# EAGLE design mosfets (EAGLE 7.7.0)
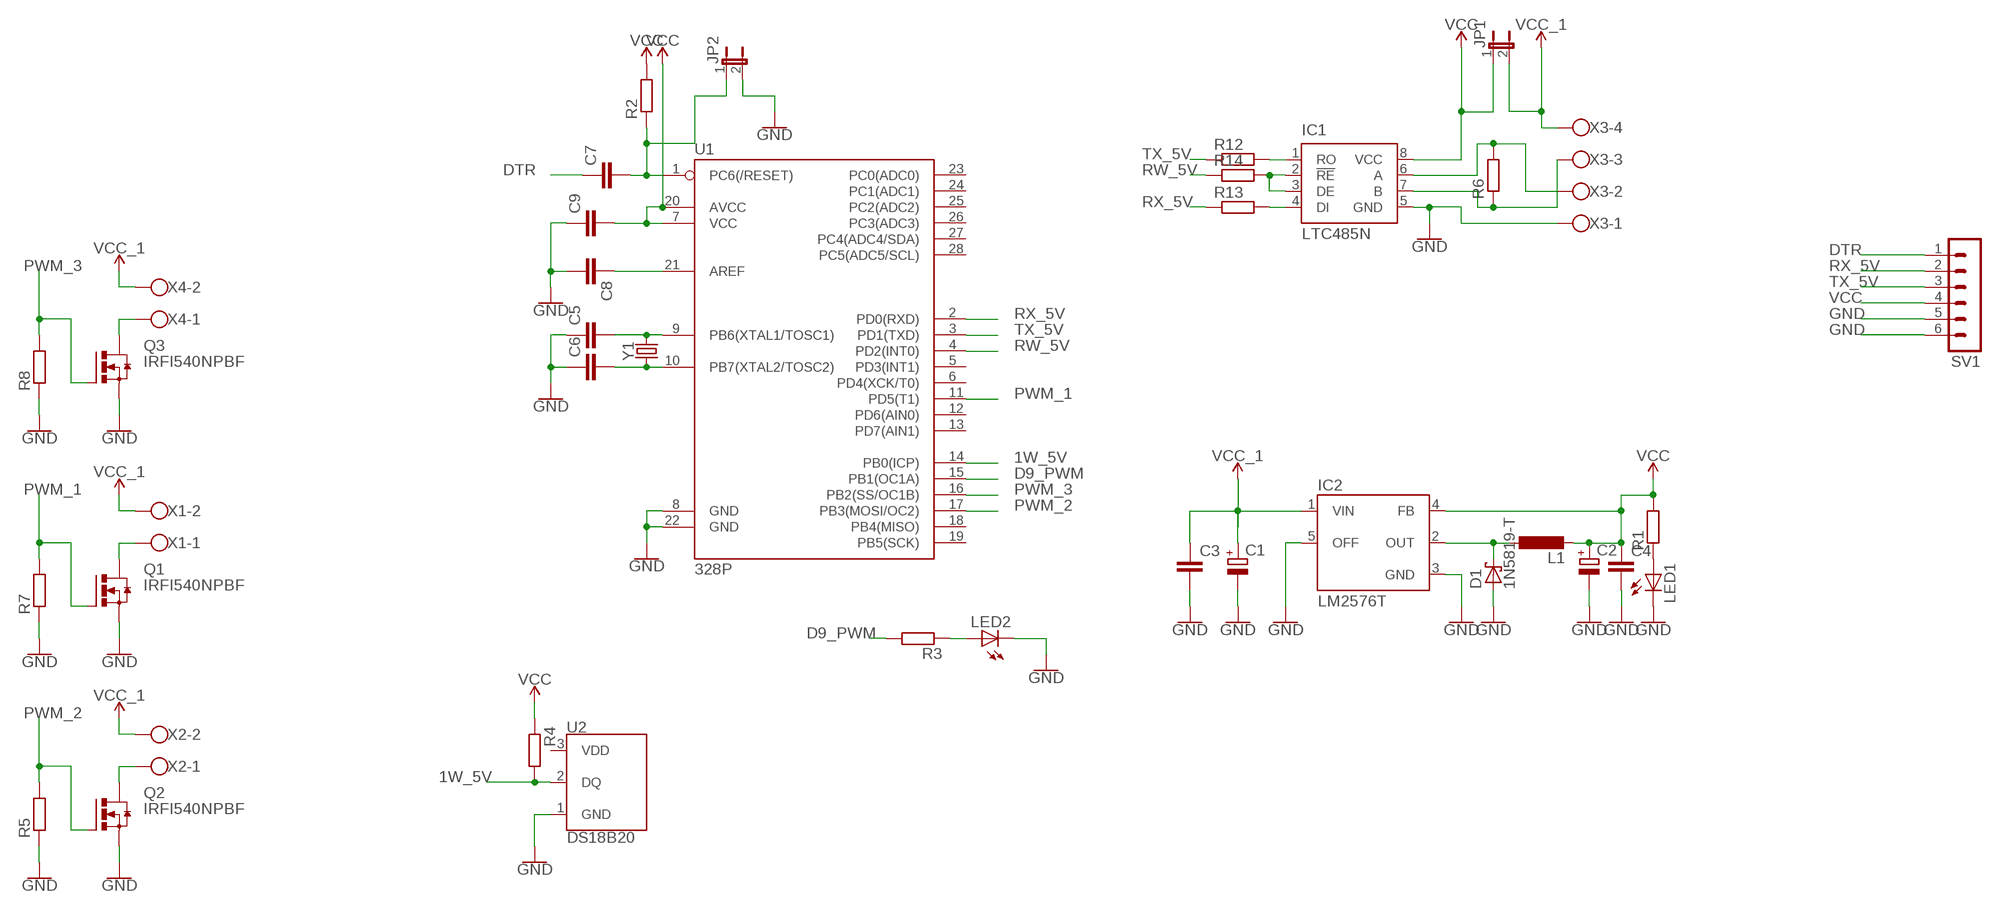
[diagram p0: schematic, sheet 1]

## Parts
C1  CPOL-EUE5-10.5  [E5-10,5]
C2  CPOL-EUE5-10.5  [E5-10,5]
C3  C-EU025-025X050  [C025-025X050]
C4  C-EU025-025X050  [C025-025X050]
C5  C-EU025-025X050  [C025-025X050]
C6  C-EU025-025X050  [C025-025X050]
C7  C-EU025-025X050  [C025-025X050]
C8  C-EU025-025X050  [C025-025X050]
C9  C-EU025-025X050  [C025-025X050]
D1  1N5819-T  [DO41-7.6]
IC1  LTC485N  [DIL08]
IC2  LM2576T  [TO220-5]
JP1  JP1E  [JP1]
JP2  JP1E  [JP1]
L1  L-EUTJ3-U1  [TJ3-U1]
LED1  LED5MM  [LED5MM]
LED2  LED5MM  [LED5MM]
Q1  IRFI540NPBF  [TO220BH]
Q2  IRFI540NPBF  [TO220BH]
Q3  IRFI540NPBF  [TO220BH]
R1  R-EU_0204/7  [0204/7]
R2  R-EU_0204/7  [0204/7]
R3  R-EU_0204/7  [0204/7]
R4  R-EU_0204/7  [0204/7]
R5  R-EU_0204/7  [0204/7]
R6  R-EU_0204/7  [0204/7]
R7  R-EU_0204/7  [0204/7]
R8  R-EU_0204/7  [0204/7]
R12  R-EU_0204/7  [0204/7]
R13  R-EU_0204/7  [0204/7]
R14  R-EU_0204/7  [0204/7]
SV1  MA06-1  [MA06-1]
U1  328P  ATMEGA328P_PDIP  [DIP28]
U2  DS18B20  [TO-92-AMMO]
X1  W237-102  [W237-102]
X2  W237-102  [W237-102]
X3  W237-4  [W237-4]
X4  W237-102  [W237-102]
Y1  CRYSTALPTH-HC49US  [HC49US]

## Nets
1W_5V: R4.2 U1.14(PB0(ICP)) U2.2(DQ)
D9_PWM: R3.2 U1.15(PB1(OC1A))
DTR: C7.1 SV1.1
GND: C1.- C2.- C3.2 C4.2 C5.1 C6.1 C8.2 C9.1 D1.A IC1.5(GND) IC2.3(GND) IC2.5(OFF) JP2.2 LED1.K(C) LED2.K(C) Q1.S Q2.S Q3.S R5.1 R7.1 R8.1 SV1.5 SV1.6 U1.8(GND) U1.22(GND) U2.1(GND) X3.1
N$1: LED1.A R1.1
N$2: C5.2 U1.9(PB6(XTAL1/TOSC1)) Y1.2
N$3: C6.2 U1.10(PB7(XTAL2/TOSC2)) Y1.1
N$4: IC1.4(DI) R13.2
N$5: IC1.7(B) R6.1 X3.3
N$6: C8.1 U1.21(AREF)
N$7: LED2.A R3.1
N$8: IC1.1(RO) R12.2
N$9: D1.C IC2.2(OUT) L1.1
N$10: C7.2 JP2.1 R2.1 U1.1(PC6(/RESET))
N$11: IC1.6(A) R6.2 X3.2
N$12: Q1.D X1.1
N$13: IC1.2(!RE) IC1.3(DE) R14.2
N$16: Q2.D X2.1
N$17: Q3.D X4.1
PWM_1: Q1.G R7.2 U1.11(PD5(T1))
PWM_2: Q2.G R5.2 U1.17(PB3(MOSI/OC2))
PWM_3: Q3.G R8.2 U1.16(PB2(SS/OC1B))
RW_5V: R14.1 U1.4(PD2(INT0))
RX_5V: R13.1 SV1.2 U1.2(PD0(RXD))
TX_5V: R12.1 SV1.3 U1.3(PD1(TXD))
VCC: C2.+ C4.1 C9.2 IC1.8(VCC) IC2.4(FB) JP1.1 L1.2 R1.2 R2.2 R4.1 SV1.4 U1.7(VCC) U1.20(AVCC)
VCC_1: C1.+ C3.1 IC2.1(VIN) JP1.2 X1.2 X2.2 X3.4 X4.2
Unconnected: U1.5(PD3(INT1)) U1.6(PD4(XCK/T0)) U1.12(PD6(AIN0)) U1.13(PD7(AIN1)) U1.18(PB4(MISO)) U1.19(PB5(SCK)) U1.23(PC0(ADC0)) U1.24(PC1(ADC1)) U1.25(PC2(ADC2)) U1.26(PC3(ADC3)) U1.27(PC4(ADC4/SDA)) U1.28(PC5(ADC5/SCL))

## Power pins joined to a net without a drawn wire
VDD: U2.3(VDD)

## Library data of the parts
C1 C2 = rcl:CPOL-EU: POLARIZED CAPACITOR, European symbol
C3-C9 = rcl:C-EU: CAPACITOR, European symbol
D1 = diode:1N581*: 1.0A SCHOTTKY BARRIER RECTIFIER Source: http://www.diodes.com/datasheets/ds23001.pdf
IC1 = linear-technology:LTC485: Low Power RS485 Interface Transceiver Source: http://www.linear.com/pc/downloadDocument.do?navId=H0,C1,C1007,C1017,P2064,D1718; OC_FARNELL: unknown; OC_NEWARK: unknown
IC2 = v-reg-3:LM2576: National Semiconductor <http://www.national.com> 3.0A "Simple Switcher"(c) 52kHz, Vout 1.23-37V (HV: 57V), Vin 40V (HV: 60V), 50µA standby current
JP1 JP2 = jumper:JP1E: JUMPER
L1 = resistor:L-EU: INDUCTOR, European symbol
LED1 LED2 = led:LED: LED OSRAM: - CHIPLED LG R971, LG N971, LY N971, LG Q971, LY Q971, LO R971, LY R971 LH N974, LH R974 LS Q976, LO Q976, LY Q976 LO Q996 - Hyper CHIPLED LW Q18S LB Q993, LB Q99A, LB R99A - SideLED LS A670, LO A670, LY A670, LG A670, LP A670 LB A673, LV A673, LT A673, LW A673 LH A674 LY A675 LS A676, LA A676, LO A676, LY A676, LW A676 LS A679, LY A679, LG A679 - Hyper Micro SIDELED® LS Y876, LA Y876, LO Y876, LY Y876 LT Y87S - SmartLED LW L88C, LW L88S LB L89C, LB L89S, LG L890 LS L89K, LO L89K, LY L89K LS L896, LA L896, LO L896, LY L896 - TOPLED LS T670, LO T670, LY T670, LG T670, LP T670 LSG T670, LSP T670, LSY T670, LOP T670, LYG T670 LG T671, LOG T671, LSG T671 LB T673, LV T673, LT T673, LW T673 LH T674 LS T676, LA T676, LO T676, LY T676, LB T676, LH T676, LSB T676, LW T676 LB T67C, LV T67C, LT T67C, LS T67K, LO T67K, LY T67K, LW E67C LS E67B, LA E67B, LO E67B, LY E67B, LB E67C, LV E67C, LT E67C LW T67C LS T679, LY T679, LG T679 LS T770, LO T770, LY T770, LG T770, LP T770 LB T773, LV T773, LT T773, LW T773 LH T774 LS E675, LA E675, LY E675, LS T675 LS T776, LA T776, LO T776, LY T776, LB T776 LHGB T686 LT T68C, LB T68C - Hyper Mini TOPLED® LB M676 - Mini TOPLED Santana® LG M470 LS M47K, LO M47K, LY M47K Source: http://www.osram.convergy.de LUXEON: - LUMILED® LXK2-PW12-R00, LXK2-PW12-S00, LXK2-PW14-U00, LXK2-PW14-V00 LXK2-PM12-R00, LXK2-PM12-S00, LXK2-PM14-U00 LXK2-PE12-Q00, LXK2-PE12-R00, LXK2-PE12-S00, LXK2-PE14-T00, LXK2-PE14-U00 LXK2-PB12-K00, LXK2-PB12-L00, LXK2-PB12-M00, LXK2-PB14-N00, LXK2-PB14-P00, LXK2-PB14-Q00 LXK2-PR12-L00, LXK2-PR12-M00, LXK2-PR14-Q00, LXK2-PR14-R00 LXK2-PD12-Q00, LXK2-PD12-R00, LXK2-PD12-S00 LXK2-PH12-R00, LXK2-PH12-S00 LXK2-PL12-P00, LXK2-PL12-Q00, LXK2-PL12-R00 Source: www.luxeon.com KINGBRIGHT: KA-3528ASYC Source: www.kingbright.com
Q1-Q3 = transistor-power:IRFI540NPBF: HEXFET Power MOISFET VDSS = 100V, RDS(on) = 0.052 Ohm, ID = 20A, VGS(th) = 2.0 -- 4.0V Source: http://www.irf.com/product-info/datasheets/data/irfi540npbf.pdf
R1-R8 R12-R14 = rcl:R-EU_: RESISTOR, European symbol
SV1 = con-lstb:MA06-1: PIN HEADER; OC_FARNELL: unknown; OC_NEWARK: unknown
U1 = SparkFun-IC-Microcontroller:ATMEGA328P_PDIP: Atmel 328P Through hole ATMEGA328P uC used in the Arduino 32kb flash, 1k EEPROM, 2k SRAM Datasheet <http://www.sparkfun.com/datasheets/Components/SMD/ATMega328.pdf> SparkFun Products Storefront component: AVR 28 Pin 20MHz 32K 6A/D - ATMega328P <https://www.sparkfun.com/products/9061> (COM-09061) SparkFun Simon Says - Through-Hole Soldering Kit <https://www.sparkfun.com/products/10547> (KIT-10547) SparkFun Learn to Solder - Simon Says <https://www.sparkfun.com/products/13708> (KIT-13708) SparkFun BigTime Watch Kit <https://www.sparkfun.com/products/11734> (KIT-11734) SparkFun ClockIt <https://www.sparkfun.com/products/10930> (KIT-10930) SparkFun Serial Enabled LCD Kit <https://www.sparkfun.com/products/10097> (LCD-10097) SparkFun Simon Tilts - Through Hole Soldering Kit <https://www.sparkfun.com/products/12634> (KIT-12634) SparkFun Frequency Counter Kit <https://www.sparkfun.com/products/10140> (KIT-10140) FabFM Radio Kit <https://www.sparkfun.com/products/11043> (KIT-11043) SparkFun Binary Blaster Kit <https://www.sparkfun.com/products/12037> (KIT-12037) SparkFun Metro-Gnome <https://www.sparkfun.com/products/9236> (KIT-09236) ATmega328 with Arduino Optiboot (Uno) <https://www.sparkfun.com/products/10524> (DEV-10524); PROD_ID: IC-09136
U2 = SparkFun-Sensors:DS18B20: Dallas/Maxim DS18B20 1-Wire Temperature Sensor The DS18B20 reports degrees C with 9 to 12-bit precision, -55C to 125C (+/-0.5C). Each sensor has a unique 64-Bit Serial number etched into it - allows for a huge number of sensors to be used on one data bus. Datasheet <http://datasheets.maximintegrated.com/en/ds/DS18B20.pdf> SparkFun Products One Wire Digital Temperature Sensor - DS18B20 <https://www.sparkfun.com/products/245> (SEN-00245); STORE_ID: SEN-00245
X1 X2 X4 = con-wago-500:W237-102: WAGO SCREW CLAMP; MPN: 237-102; OC_FARNELL: unknown; OC_NEWARK: 70K9898
X3 = con-wago-500:W237-4: WAGO SCREW CLAMP; OC_FARNELL: unknown; OC_NEWARK: unknown
Y1 = SparkFun-Clocks:CRYSTAL: Crystals (Generic) These are passive quartz crystals, which can be used as a clock source for a microcontroller. Crystal's are two-terminal devices. They require external "load" capacitors to generate an oscillating signal.

## Board
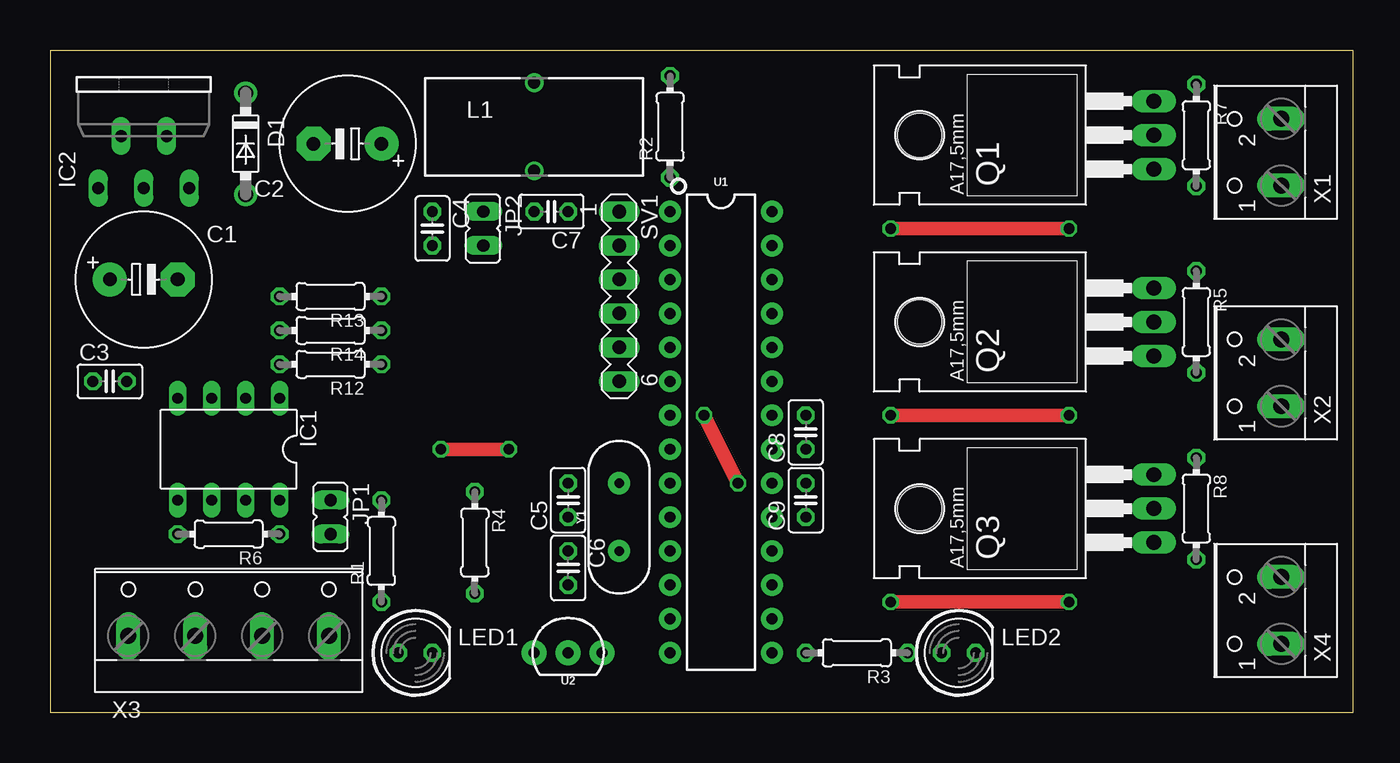
[diagram p1: board, top side]
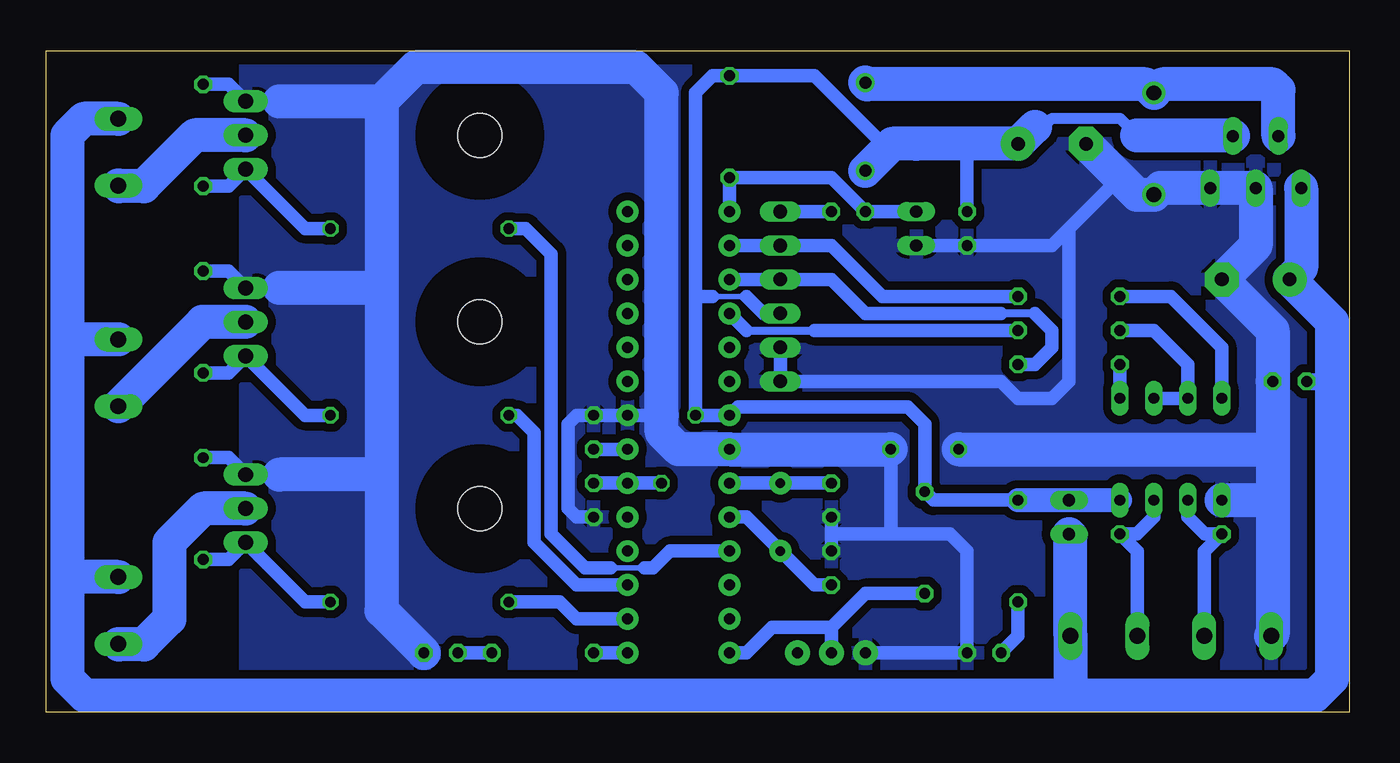
[diagram p2: board, bottom side, seen from below]

Size 97.46 x 49.52 mm. Coordinates in mm from the lower left corner, seen from the top.
Outline: 0,0 97.46,0 97.46,49.52 0,49.52 0,0
Copper layers (1*16): Top 0.035mm / dielectric 1.5mm / Bottom 0.035mm
Design rules "default": minimum track width 10mil, minimum drill 24mil, track to track 8mil, track to pad 8mil, pad to pad 8mil, via to via 8mil, smd to smd 8mil, copper to edge 40mil, drill to drill 8mil, minimum pad ring 10mil, minimum via ring 8mil, stop-mask expansion 4mil, vias tented up to drill 0mil, thermal gap 10mil

### Footprints (pad centres in the part's own frame; a part is rotated, then mirrored left to right if it is on the bottom)
E5-10,5 = drill 1.016 pad 2.54: + -2.54,0 | drill 1.016 pad 2.54 octagon: - 2.54,0
C025-025X050 = drill 0.813 octagon: 1 -1.27,0; 2 1.27,0
DO41-7.6 = drill 1.1 pad 1.7: A 3.81,0; C -3.81,0
DIL08 = drill 0.813 long: 1 -3.81,-3.81; 2 -1.27,-3.81; 3 1.27,-3.81; 4 3.81,-3.81; 5 3.81,3.81; 6 1.27,3.81; 7 -1.27,3.81; 8 -3.81,3.81
TO220-5 = drill 0.9 long: 1 -3.4,-8.4; 2 -1.7,-4.5; 3 0,-8.4; 4 1.7,-4.5; 5 3.4,-8.4
JP1 = drill 0.914 long: 1 0,-1.27; 2 0,1.27
TJ3-U1 = drill 0.9: 1 -3.3,0; 2 3.3,0
LED5MM = drill 0.813 octagon: A -1.27,0; K 1.27,0
TO220BH = drill 1.118 long: D 0,-6.35; G -2.54,-6.35; S 2.54,-6.35 | hole 3.302: 0,11.176
0204/7 = drill 0.813 octagon: 1 -3.81,0; 2 3.81,0
MA06-1 = drill 1.016 long: 1 -6.35,0; 2 -3.81,0; 3 -1.27,0; 4 1.27,0; 5 3.81,0; 6 6.35,0
DIP28 = drill 0.813 pad 1.626: 1 -16.51,-3.81; 2 -13.97,-3.81; 3 -11.43,-3.81; 4 -8.89,-3.81; 5 -6.35,-3.81; 6 -3.81,-3.81; 7 -1.27,-3.81; 8 1.27,-3.81; 9 3.81,-3.81; 10 6.35,-3.81; 11 8.89,-3.81; 12 11.43,-3.81; 13 13.97,-3.81; 14 16.51,-3.81; 15 16.51,3.81; 16 13.97,3.81; 17 11.43,3.81; 18 8.89,3.81; 19 6.35,3.81; 20 3.81,3.81; 21 1.27,3.81; 22 -1.27,3.81; 23 -3.81,3.81; 24 -6.35,3.81; 25 -8.89,3.81; 26 -11.43,3.81; 27 -13.97,3.81; 28 -16.51,3.81
TO-92-AMMO = drill 0.813 pad 1.88: 1 -2.54,0; 2 0,0; 3 2.54,0
W237-102 = drill 1.194 long: 1 -2.5,-1.27; 2 2.5,-1.27
W237-4 = drill 1.194 long: 1 -7.5,-1.27; 2 -2.5,-1.27; 3 2.5,-1.27; 4 7.5,-1.27
HC49US = drill 0.7 pad 1.651: 1 -2.54,0; 2 2.54,0

### Placement (x,y rotation side)
C1  6.99,32.38 0 top
C2  22.23,42.55 180 top
C3  4.45,24.77 0 top
C4  28.57,36.2 270 top
C5  38.73,15.88 90 top
C6  38.73,10.79 270 top
C7  37.47,37.47 180 top
C8  56.52,20.95 90 top
C9  56.52,15.88 90 top
D1  14.61,42.55 270 top
IC1  13.34,19.68 180 top
IC2  6.99,47.62 0 top
JP1  20.95,14.61 180 top
JP2  32.38,36.2 180 top
L1  36.2,43.81 270 top
LED1  27.3,4.45 0 top
LED2  67.94,4.45 0 top
Q1  76.2,43.18 90 top
Q2  76.2,29.21 90 top
Q3  76.2,15.24 90 top
R1  24.77,12.06 90 top
R2  46.35,43.81 90 top
R3  60.33,4.45 180 top
R4  31.75,12.7 270 top
R5  85.72,29.21 270 top
R6  13.34,13.34 180 top
R7  85.72,43.18 270 top
R8  85.72,15.24 270 top
R12  20.95,26.04 180 top
R13  20.95,31.11 180 top
R14  20.95,28.57 180 top
SV1  42.55,31.11 270 top
U1  50.16,20.95 270 top
U2  38.73,4.45 0 top
X1  90.81,41.91 90 top
X2  90.81,25.4 90 top
X3  13.34,6.99 0 top
X4  90.81,7.62 90 top
Y1  42.55,14.61 90 top

### Tracks (layer width: path | path; a pad name or v marks a point on that pad's centre or on a via)
1W_5V
  Bottom 1.016: R4.2 36.2,8.89 38.73,6.35 | 38.73,6.35 U2.2 | U1.14 45.09,4.45 43.18,6.35 38.73,6.35
D9_PWM
  Bottom 1.016: U1.15 R3.2
DTR
  Bottom 1.016: SV1.1 C7.1
GND  (via drill 0.8)
  Top 1.016: v34.29,19.68 v29.21,19.68
  Bottom 1.016: JP2.2 C4.2 22.23,34.92 20.95,36.2 | 20.95,36.2 17.14,40.01 | 20.95,36.2 20.95,24.77 22.23,23.5 24.77,23.5 26.04,24.77 SV1.6 SV1.5 | U2.1 LED1.K 28.57,12.06 29.84,13.34 34.29,13.34 | R8.1 83.82,19.05 Q3.S 80.01,17.78 | R5.1 83.82,33.02 Q2.S 80.01,31.75 | R7.1 83.82,46.99 Q1.S 80.01,45.72 | 51.44,22.23 U1.22 C8.2 57.78,22.23 58.42,21.59 58.42,15.24 57.78,14.61 C9.1 | C5.1 38.73,13.34 | 38.73,13.34 C6.1 | 34.29,13.34 38.73,13.34 | 34.29,13.34 v34.29,19.68
  Bottom 2.54: C2.- 17.14,40.01 15.88,38.73 D1.A 14.12,39.23 IC2.5 IC2.3 6.99,34.92 C1.- 5.71,28.57 C3.2 | 80.01,45.72 72.39,45.72 | 72.39,45.72 72.39,31.75 | 72.39,31.75 80.01,31.75 | 72.39,31.75 72.39,17.78 | 72.39,17.78 80.01,17.78 | 72.39,17.78 72.39,7.62 LED2.K | 72.39,45.72 69.85,48.26 53.34,48.26 51.44,46.35 51.44,22.23 51.44,20.95 50.16,19.68 U1.8 v34.29,19.68 | v29.21,19.68 5.71,19.68 C3.2 | C3.2 5.71,15.88 | 5.71,15.88 5.71,5.83 X3.1 | IC1.5 5.71,15.88
  pour Bottom (isolate 0.61): 0,49.53 82.55,49.53 82.55,0 0,0
N$1
  Bottom 1.016: LED1.A 24.77,5.71 R1.1
N$2
  Bottom 1.016: U1.9 Y1.2 C5.2
N$3
  Bottom 1.016: U1.10 45.09,14.61 Y1.1 40.01,9.53 C6.2
N$4
  Bottom 1.016: R13.2 13.34,31.11 9.53,27.3 IC1.4
N$5
  Bottom 1.016: X3.3 15.84,12.03 R6.1 15.88,13.34 14.61,14.61 IC1.7
N$6
  Bottom 1.016: U1.21 C8.1
N$7
  Bottom 1.016: R3.1 LED2.A
N$8
  Bottom 1.016: R12.2 IC1.1
N$9
  Bottom 2.54: IC2.2 5.29,46.56 5.71,46.99 13.97,46.99 D1.C 15.24,46.99 36.07,46.99 L1.1
N$10
  Bottom 1.016: JP2.1 C7.2 38.73,40.01 R2.1 U1.1
N$11
  Bottom 1.016: IC1.6 12.06,14.61 10.79,13.34 R6.2 10.84,12.03 X3.2
N$12
  Bottom 2.54: Q1.D 86.36,43.18 90.17,39.37 92.03,39.37 X1.1
N$13
  Bottom 1.016: R14.2 14.61,28.57 12.06,26.04 IC1.3 IC1.2
N$16
  Bottom 2.54: Q2.D 85.77,29.21 X2.1
N$17
  Bottom 2.54: Q3.D 85.72,15.24 88.27,12.7 88.27,6.99 90.17,5.08 92.03,5.08 X4.1
PWM_1  (via drill 0.8)
  Top 1.016: v76.2,36.2 v62.87,36.2
  Bottom 0.406: 52.7,10.79 55.24,10.79
  Bottom 1.016: R7.2 83.82,39.37 Q1.G 78.11,36.2 v76.2,36.2 | v62.87,36.2 61.59,36.2 59.69,34.29 59.69,13.34 57.15,10.79 55.24,10.79 | U1.11 50.8,12.06 52.07,10.79 52.7,10.79
PWM_2  (via drill 0.8)
  Top 1.016: v76.2,22.23 v62.87,22.23
  Bottom 1.016: R5.2 83.82,25.4 Q2.G 78.11,22.23 v76.2,22.23 | v62.87,22.23 62.23,22.23 60.96,20.95 60.96,12.7 57.78,9.53 U1.17
PWM_3  (via drill 0.8)
  Top 1.016: v76.2,8.26 v62.87,8.26
  Bottom 1.016: R8.2 83.82,11.43 Q3.G 78.11,8.26 v76.2,8.26 | v62.87,8.26 59.05,8.26 57.78,6.99 U1.16
RW_5V
  Bottom 0.61: 45.09,28.57 40.01,28.57
  Bottom 1.016: U1.4 45.09,28.57 | 40.01,28.57 R14.1
RX_5V
  Bottom 1.016: U1.2 SV1.2 38.73,34.92 34.92,31.11 R13.1
TX_5V
  Bottom 0.61: 23.5,29.84 26.04,29.84
  Bottom 1.016: U1.3 SV1.3 38.73,32.38 36.2,29.84 26.04,29.84 | 23.5,29.84 22.23,28.57 22.23,27.3 23.5,26.04 R12.1
VCC  (via drill 0.8)
  Top 1.016: v48.9,22.23 v51.44,17.14
  Bottom 0.406: 45.09,31.11 47.62,31.11
  Bottom 0.813: 23.5,43.81 22.86,43.81 22.23,44.45 17.14,44.45 15.88,43.18
  Bottom 1.016: 31.75,41.91 32.38,42.55 | C4.1 28.57,42.55 | C9.2 U1.20 v51.44,17.14 | R1.2 31.11,15.88 R4.1 31.75,21.59 33.02,22.86 45.72,22.86 U1.7 v48.9,22.23 48.9,31.11 | 48.9,31.11 48.9,46.35 47.62,47.62 R2.2 40.01,47.62 34.55,42.16 | SV1.4 43.81,29.84 45.09,31.11 | 47.62,31.11 48.9,31.11
  Bottom 1.778: R1.2 JP1.1 IC1.8
  Bottom 2.54: L1.2 34.55,42.16 34.16,42.55 32.38,42.55 28.57,42.55 C2.+ 23.5,43.81 | 15.88,43.18 8.74,43.18 IC2.4
VCC_1
  Bottom 1.27: C3.1 1.91,24.77 1.27,25.4
  Bottom 2.54: IC2.1 3.58,33.24 C1.+ 1.27,29.21 1.27,25.4 1.27,2.54 2.54,1.27 20.95,1.27 | JP1.2 20.84,13.21 X3.4 20.84,1.39 20.95,1.27 | X1.2 94.66,44.41 95.89,43.18 95.89,27.94 | 95.89,27.94 95.89,10.16 | 95.89,10.16 95.89,2.54 94.61,1.27 20.95,1.27 | X4.2 95.84,10.12 95.89,10.16 | X2.2 95.84,27.9 95.89,27.94